# EasyEDA schematic SCH_FM reciever circuit_01_2023-11-06.json
TITLE: Sheet_1; REV: 1.0; Date: 2023-10-30; Sheet: 1/1; Drawn By: pavan3612; Company: Your Company
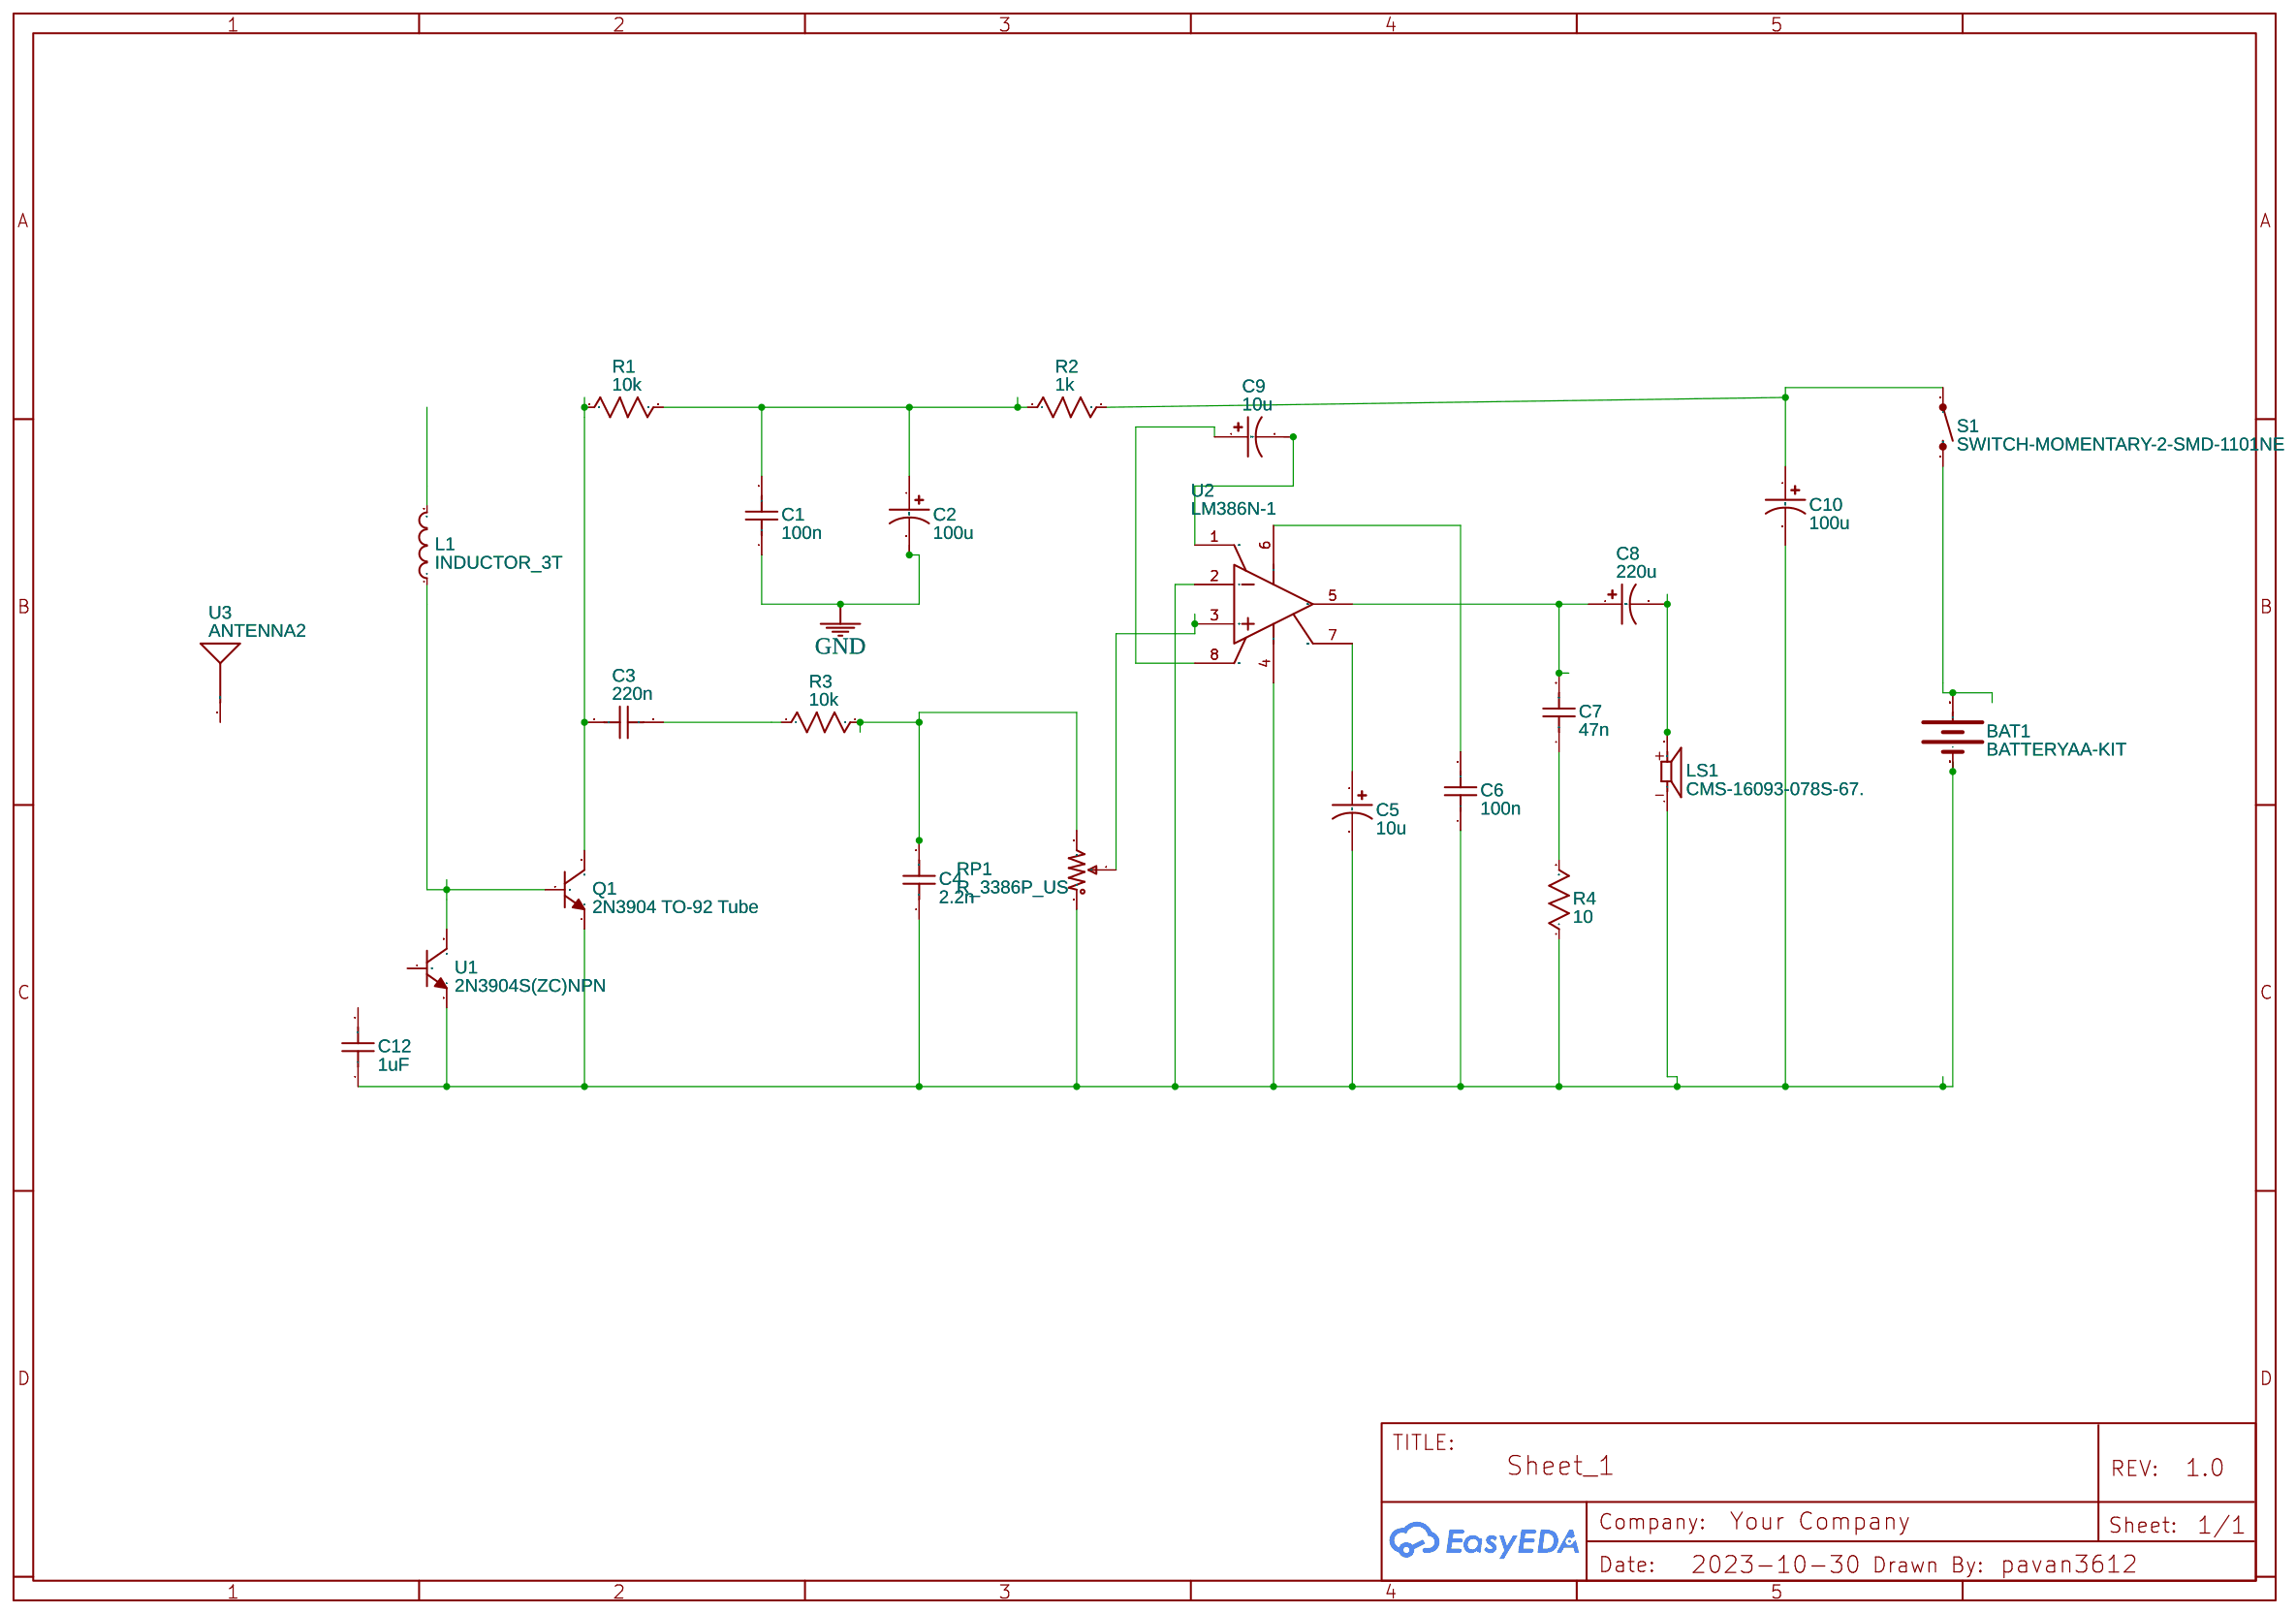
[diagram p0: schematic sheet]

## Parts
BAT1  BATTERYAA-KIT  [BATTERY-AA-KIT]
C1  100n  [C0603]
C2  100u  [CASE-A_3216]
C3  220n  [C0603]
C4  2.2n  [C0603]
C5  10u  [CASE-A_3216]
C6  100n  [C0603]
C7  47n  [C0603]
C8  220u  [CASE-A_3216]
C9  10u  [CASE-A_3216]
C10  100u  [CASE-A_3216]
C12  1uF  [CAP-TH_L17.0-W8.5-P15.00-D1.2-FD]
L1  INDUCTOR_3T  [IND-TH_L4.2-W2.7-P2.10-S3.60]
LS1  CMS-16093-078S-67.  [SPKR_CMS-16093-078S-67/]
Q1  2N3904 TO-92 Tube  [TO-92-3_L4.9-W3.7-P2.54-L]
R1  10k  [R0603]
R2  1k  [R0603]
R3  10k  [R0603]
R4  10  [R0603]
RP1  R_3386P_US  [RES-ADJ-TH_3386P]
S1  SWITCH-MOMENTARY-2-SMD-1101NE  [TACTILE-SWITCH-1101NE]
U1  2N3904S(ZC)NPN  [SOT-23-3_L2.9-W1.3-P0.95-LS2.4-BR]
U2  LM386N-1  [DIP-8_L10.0-W6.5-P2.54-LS7.6-BL]
U3  ANTENNA2  [ANTENNA-CHIP_2500AT44M0400]

## Library data of the parts
BAT1 = BATTERYAA-KIT: Battery Holders; Contributor: SparkFun
C1 C3 C4 C6 C7 = C_0603_US: Contributor: LCEDA_Lib
C2 C5 C8-C10 = C_Tan_SMD_A_US: Contributor: LCEDA_Lib
C12 = 1uf/250V/CBBCapacitor: Supplier Part: C29321; Supplier: LCSC; Manufacturer: ReliaPro; JLCPCB Part Class: Extended Part; link: https://lcsc.com/eda_search?q=C29321&%26type=1&ref=editor
L1 = INDUCTOR_3T: Contributor: LCSC; Supplier: LCSC; Supplier Part: C9900012677; Manufacturer: null; JLCPCB Part Class: Extended Part; link: https://lcsc.com/eda_search?q=C9900012677&%26type=1&ref=editor
LS1 = CMS-16093-078S-67.: Contributor: LLC "EC co."; Manufacturer Part: CMS-16093-078S-67; Supplier: Mouser; Supplier Part: 490-CMS-16093-078S67; Manufacturer: CUI Devices; link: https://eu.mouser.com/ProductDetail/CUI-Devices/CMS-16093-078S-67?qs=w%2Fv1CP2dgqoqpiUP8V277w%3D%3D
Q1 = 2N3904 TO-92 Tube: Supplier: LCSC; Manufacturer: CJ(江苏长电/长晶); Manufacturer Part: 2N3904-TA; Supplier Part: C2081; JLCPCB Part Class: Extended Part; link: https://lcsc.com/eda_search?q=C2081&%26type=1&ref=editor
R1-R4 = R_0603_US: Contributor: LCEDA_Lib
RP1 = R_3386P_US: Supplier: LCSC; Contributor: LCEDA_Lib; value(Ω): 10K
S1 = SWITCH-MOMENTARY-2-SMD-1101NE: Contributor: Pinoccio
U1 = 2N3904S(ZC)NPN: Contributor: lcsc; Supplier: LCSC; Supplier Part: C9900013034; Manufacturer: null; JLCPCB Part Class: Extended Part; link: https://lcsc.com/eda_search?q=C9900013034&%26type=1&ref=editor
U2 = LM386N-1: Supplier: LCSC; Manufacturer: TI(德州仪器); Manufacturer Part: LM386N-1/NOPB; Supplier Part: C9723; JLCPCB Part Class: Extended Part; link: https://lcsc.com/eda_search?q=C9723&%26type=1&ref=editor
U3 = ANTENNA2: Contributor: SparkFun

## Nets
GND: C1.1 C2.2
Net-(BAT1-GND@1): BAT1.GND@1(-) C4.1 C5.2 C6.1 C10.2 C12.1 LS1.N Q1.1(E) R4.1 RP1.1 U1.2(E) U2.2(IN-) U2.4(GND)
Net-(BAT1-PWR@1): BAT1.PWR@1(+) S1.P$2(2)
Net-(C1-2): C1.2 C2.1 R1.2 R2.1
Net-(C3-1): C3.1 Q1.3(C) R1.1
Net-(C3-2): C3.2 R3.1
Net-(C4-2): C4.2 R3.2 RP1.3
Net-(C5-1): C5.1 U2.7(BYPASS)
Net-(C6-2): C6.2 U2.6(VS)
Net-(C7-1): C7.1 R4.2
Net-(C7-2): C7.2 C8.1 U2.5(VOUT)
Net-(C8-2): C8.2 LS1.P
Net-(C9-1): C9.1 U2.8(GAIN)
Net-(C9-2): C9.2 U2.1(GAIN)
Net-(C10-1): C10.1 R2.2 S1.P$1(1)
Net-(L1-1): L1.1 Q1.2(B) U1.3(C)
Net-(RP1-2): RP1.2 U2.3(IN+)

Not connected (* = marked no-connect by the designer): C12 2; L1 2; U1 1(B); U3 FEED(SIGNAL)
